# EAGLE design LedArray (EAGLE 9.6.2)
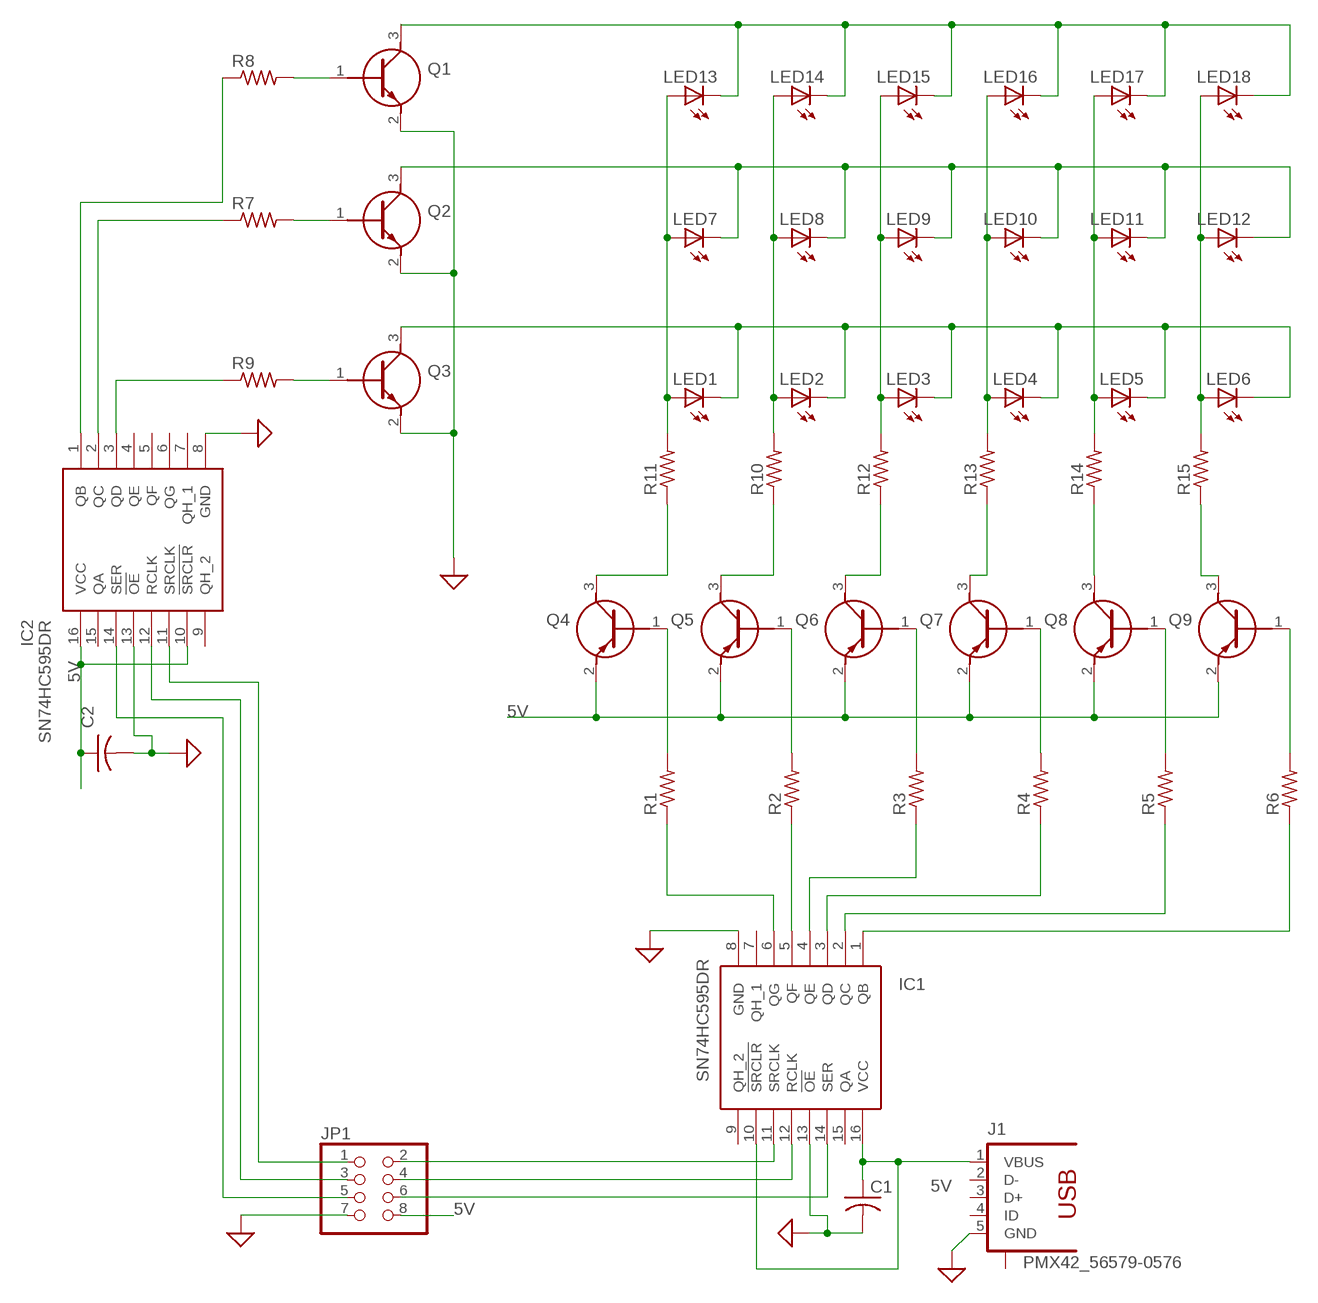
[diagram p0: schematic, sheet 1]

## Parts
C1  C-USC1206  [C1206]
C2  C-USC1206  [C1206]
IC1  SN74HC595DR  [SOIC127P600X175-16N]
IC2  SN74HC595DR  [SOIC127P600X175-16N]
J1  PMX42_56579-0576  [PMX42_56579-0576]
JP1  PINHD-2X4  [2X04]
LED1  LEDSMT1206  [1206]
LED2  LEDSMT1206  [1206]
LED3  LEDSMT1206  [1206]
LED4  LEDSMT1206  [1206]
LED5  LEDSMT1206  [1206]
LED6  LEDSMT1206  [1206]
LED7  LEDSMT1206  [1206]
LED8  LEDSMT1206  [1206]
LED9  LEDSMT1206  [1206]
LED10  LEDSMT1206  [1206]
LED11  LEDSMT1206  [1206]
LED12  LEDSMT1206  [1206]
LED13  LEDSMT1206  [1206]
LED14  LEDSMT1206  [1206]
LED15  LEDSMT1206  [1206]
LED16  LEDSMT1206  [1206]
LED17  LEDSMT1206  [1206]
LED18  LEDSMT1206  [1206]
Q1  MMBT2222A-G  [SOT95P240X115-3N]
Q2  MMBT2222A-G  [SOT95P240X115-3N]
Q3  MMBT2222A-G  [SOT95P240X115-3N]
Q4  MMBT2907A-7-F  [SOT96P240X100-3N]
Q5  MMBT2907A-7-F  [SOT96P240X100-3N]
Q6  MMBT2907A-7-F  [SOT96P240X100-3N]
Q7  MMBT2907A-7-F  [SOT96P240X100-3N]
Q8  MMBT2907A-7-F  [SOT96P240X100-3N]
Q9  MMBT2907A-7-F  [SOT96P240X100-3N]
R1  R-US_R1206  [R1206]
R2  R-US_R1206  [R1206]
R3  R-US_R1206  [R1206]
R4  R-US_R1206  [R1206]
R5  R-US_R1206  [R1206]
R6  R-US_R1206  [R1206]
R7  R-US_R1206  [R1206]
R8  R-US_R1206  [R1206]
R9  R-US_R1206  [R1206]
R10  R-US_R1206  [R1206]
R11  R-US_R1206  [R1206]
R12  R-US_R1206  [R1206]
R13  R-US_R1206  [R1206]
R14  R-US_R1206  [R1206]
R15  R-US_R1206  [R1206]

## Nets
5V: C1.1 C2.1 IC1.10(!SRCLR) IC1.16(VCC) IC2.10(!SRCLR) IC2.16(VCC) J1.1(VBUS) JP1.8 Q4.2(E) Q5.2(E) Q6.2(E) Q7.2(E) Q8.2(E) Q9.2(E)
GND: C1.2 C2.2 IC1.8(GND) IC1.13(!OE) IC2.8(GND) IC2.13(!OE) J1.5(GND) JP1.7 Q1.2(E) Q2.2(E) Q3.2(E) ; supply symbol labelled SUP
N$1: IC1.1(QB) R6.1
N$2: IC1.2(QC) R5.1
N$3: IC1.3(QD) R4.1
N$4: IC1.4(QE) R3.1
N$5: IC1.5(QF) R2.1
N$6: IC1.6(QG) R1.1
N$7: LED1.A LED7.A LED13.A R11.2
N$8: LED2.A LED8.A LED14.A R10.2
N$9: LED3.A LED9.A LED15.A R12.2
N$10: LED4.A LED10.A LED16.A R13.2
N$11: LED5.A LED11.A LED17.A R14.2
N$12: LED6.A LED12.A LED18.A R15.2
N$13: IC2.1(QB) R8.1
N$14: IC2.3(QD) R9.1
N$15: Q4.1(B) R1.2
N$16: Q5.1(B) R2.2
N$17: IC2.2(QC) R7.1
N$18: Q6.1(B) R3.2
N$19: Q1.1(B) R8.2
N$20: Q2.1(B) R7.2
N$21: Q3.1(B) R9.2
N$22: Q7.1(B) R4.2
N$23: Q8.1(B) R5.2
N$24: Q9.1(B) R6.2
N$25: Q5.3(C) R10.1
N$26: Q6.3(C) R12.1
N$27: Q7.3(C) R13.1
N$28: Q9.3(C) R15.1
N$29: Q8.3(C) R14.1
N$30: Q4.3(C) R11.1
N$31: IC2.14(SER) JP1.5
N$32: IC2.12(RCLK) JP1.3
N$33: IC2.11(SRCLK) JP1.1
N$35: IC1.11(SRCLK) JP1.2
N$36: IC1.12(RCLK) JP1.4
N$37: IC1.14(SER) JP1.6
N$43: LED13.C LED14.C LED15.C LED16.C LED17.C LED18.C Q1.3(C)
N$49: LED7.C LED8.C LED9.C LED10.C LED11.C LED12.C Q2.3(C)
N$55: LED1.C LED2.C LED3.C LED4.C LED5.C LED6.C Q3.3(C)
Unconnected: IC1.7(QH_1) IC1.9(QH_2) IC1.15(QA) IC2.4(QE) IC2.5(QF) IC2.6(QG) IC2.7(QH_1) IC2.9(QH_2) IC2.15(QA) J1.2(D-) J1.3(D+) J1.4(ID) J1.S1(S) J1.S2(S) J1.S3(S) J1.S4(S)

## Library data of the parts
C1 C2 = adafruit:C-US: CAPACITOR, American symbol
IC1 IC2 = SamacSys_Parts:SN74HC595DR: 8-Bit Shift Register 3-ST SN74HC595DRG4 SN74HC595DR, 8-stage Shift Register, Serial to Serial/Parallel, 2 ???????? 6 V, 16-Pin SOIC%0 Source: Datasheet <http://www.ti.com/lit/ds/symlink/sn74hc595.pdf>; ARROW_PART_NUMBER: SN74HC595DR; ARROW_PRICE-STOCK: https://www.arrow.com/en/products/sn74hc595dr/texas-instruments; DESCRIPTION: 8-Bit Shift Register 3-ST SN74HC595DRG4 SN74HC595DR, 8-stage Shift Register, Serial to Serial/Parallel, 2 ???????? 6 V, 16-Pin SOIC%0; HEIGHT: 1.75mm; MANUFACTURER_NAME: Texas Instruments; MANUFACTURER_PART_NUMBER: SN74HC595DR; MOUSER_PART_NUMBER: 595-SN74HC595DR; MOUSER_PRICE-STOCK: https://www.mouser.co.uk/ProductDetail/Texas-Instruments/SN74HC595DR?qs=YEaxc5757jOSYfchesGb7w%3D%3D
J1 = 52101-101-REV-A_v16:PMX42_56579-0576: USB - OTG, miniUSB Type AB, Molex
JP1 = adafruit:PINHD-2X4: PIN HEADER
LED1-LED18 = adafruit:LED: LED OSRAM: - CHIPLED LG R971, LG N971, LY N971, LG Q971, LY Q971, LO R971, LY R971 LH N974, LH R974 LS Q976, LO Q976, LY Q976 LO Q996 - Hyper CHIPLED LW Q18S LB Q993, LB Q99A, LB R99A - SideLED LS A670, LO A670, LY A670, LG A670, LP A670 LB A673, LV A673, LT A673, LW A673 LH A674 LY A675 LS A676, LA A676, LO A676, LY A676, LW A676 LS A679, LY A679, LG A679 - Hyper Micro SIDELED® LS Y876, LA Y876, LO Y876, LY Y876 LT Y87S - SmartLED LW L88C, LW L88S LB L89C, LB L89S, LG L890 LS L89K, LO L89K, LY L89K LS L896, LA L896, LO L896, LY L896 - TOPLED LS T670, LO T670, LY T670, LG T670, LP T670 LSG T670, LSP T670, LSY T670, LOP T670, LYG T670 LG T671, LOG T671, LSG T671 LB T673, LV T673, LT T673, LW T673 LH T674 LS T676, LA T676, LO T676, LY T676, LB T676, LH T676, LSB T676, LW T676 LB T67C, LV T67C, LT T67C, LS T67K, LO T67K, LY T67K, LW E67C LS E67B, LA E67B, LO E67B, LY E67B, LB E67C, LV E67C, LT E67C LW T67C LS T679, LY T679, LG T679 LS T770, LO T770, LY T770, LG T770, LP T770 LB T773, LV T773, LT T773, LW T773 LH T774 LS E675, LA E675, LY E675, LS T675 LS T776, LA T776, LO T776, LY T776, LB T776 LHGB T686 LT T68C, LB T68C - Hyper Mini TOPLED® LB M676 - Mini TOPLED Santana® LG M470 LS M47K, LO M47K, LY M47K Source: http://www.osram.convergy.de/
Q1-Q3 = SamacSys_Parts:MMBT2222A-G: RF Bipolar Transistors Source: Datasheet <http://www.comchiptech.com/admin/files/product/MMBT2222A-G RevB.pdf>; ARROW_PART_NUMBER: MMBT2222A-G; ARROW_PRICE-STOCK: https://www.arrow.com/en/products/mmbt2222a-g/comchip-technology; DESCRIPTION: RF Bipolar Transistors; HEIGHT: 1.15mm; MANUFACTURER_NAME: Comchip Technology; MANUFACTURER_PART_NUMBER: MMBT2222A-G; MOUSER_PART_NUMBER: 750-MMBT2222A-G; MOUSER_PRICE-STOCK: https://www.mouser.co.uk/ProductDetail/Comchip-Technology/MMBT2222A-G?qs=2qJf6qQ4IOIM%2FSE9iCL8gQ%3D%3D
Q4-Q9 = SamacSys_Parts:MMBT2907A-7-F: Diodes Inc MMBT2907A-7-F PNP Bipolar Transistor, -600 mA, -60 V, 3-Pin SOT-23 Source: Datasheet <https://www.diodes.com/assets/Datasheets/ds30040.pdf>; ARROW_PART_NUMBER: MMBT2907A-7-F; ARROW_PRICE-STOCK: https://www.arrow.com/en/products/mmbt2907a-7-f/diodes-incorporated; DESCRIPTION: Diodes Inc MMBT2907A-7-F PNP Bipolar Transistor, -600 mA, -60 V, 3-Pin SOT-23; HEIGHT: 1mm; MANUFACTURER_NAME: Diodes Inc.; MANUFACTURER_PART_NUMBER: MMBT2907A-7-F; MOUSER_PART_NUMBER: 621-MMBT2907A-F; MOUSER_PRICE-STOCK: https://www.mouser.co.uk/ProductDetail/Diodes-Incorporated/MMBT2907A-7-F?qs=nzdy8YbEw1%252BnciVJrv5MLg%3D%3D
R1-R15 = adafruit:R-US_: RESISTOR, American symbol

## Net classes
0 5V: width 0.508 mm

## Board
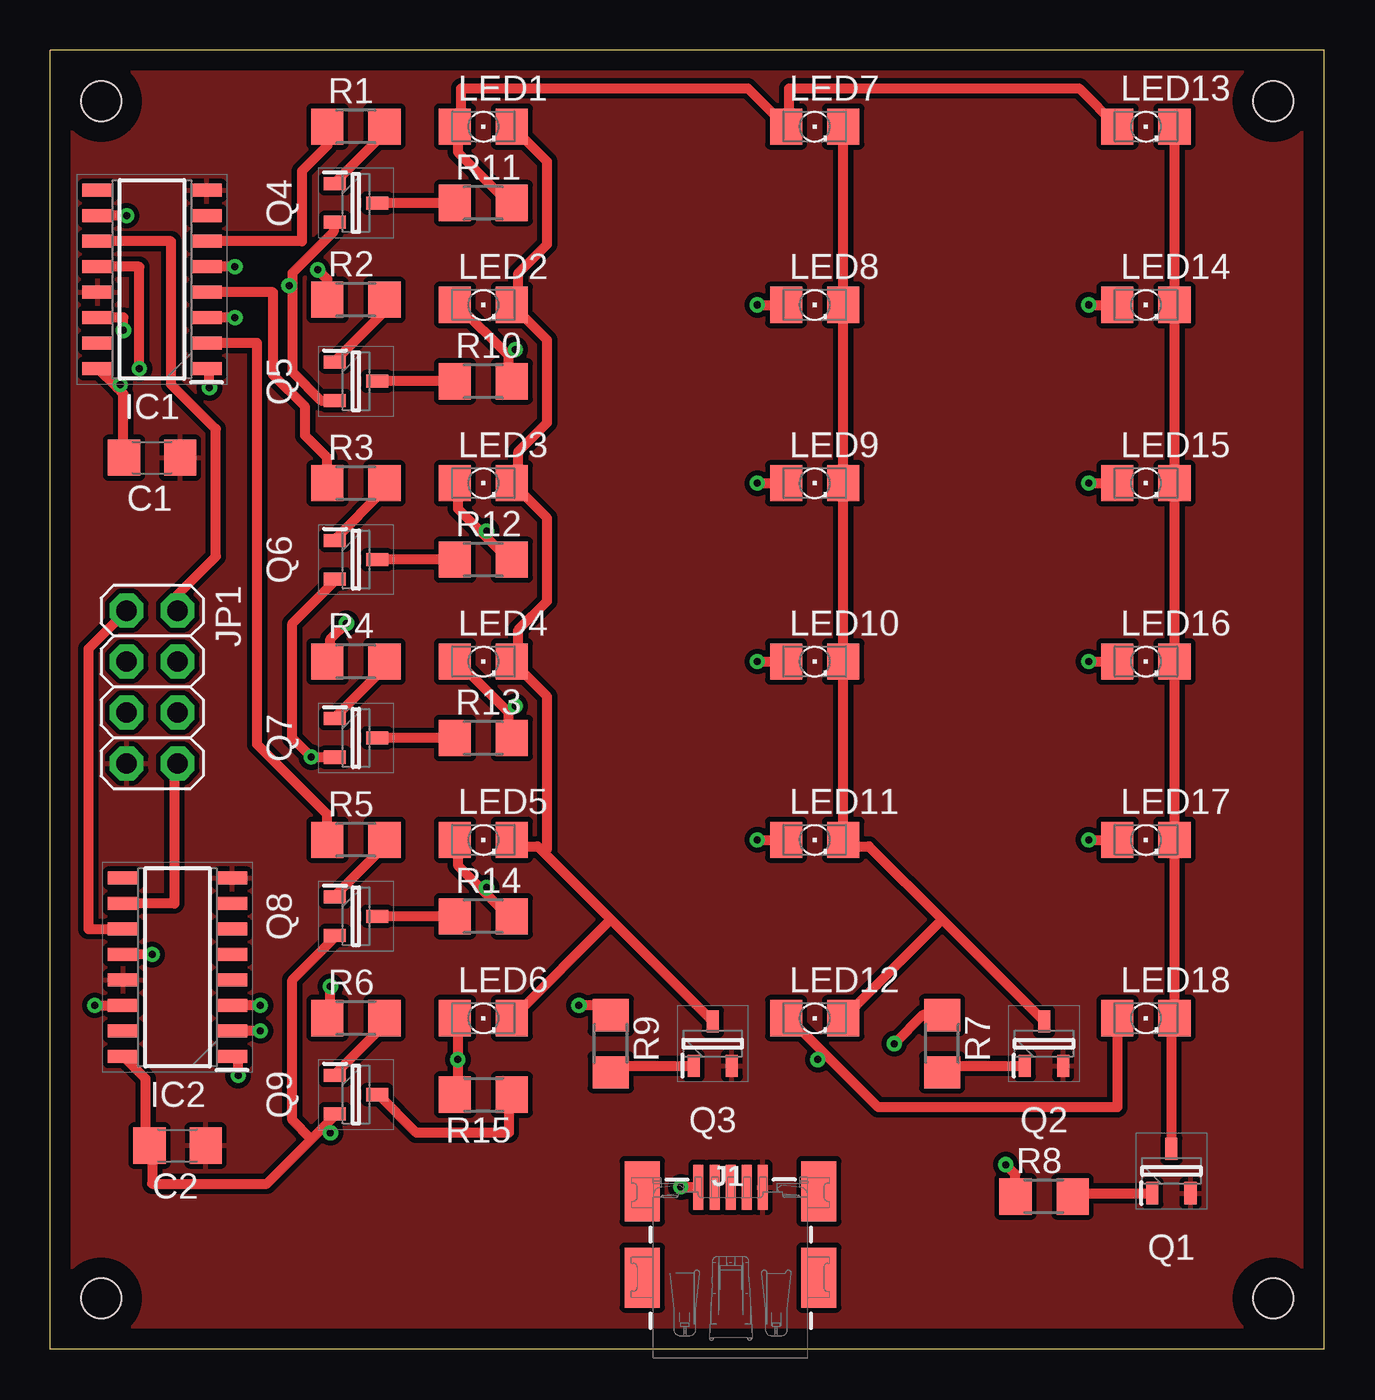
[diagram p1: board, top side]
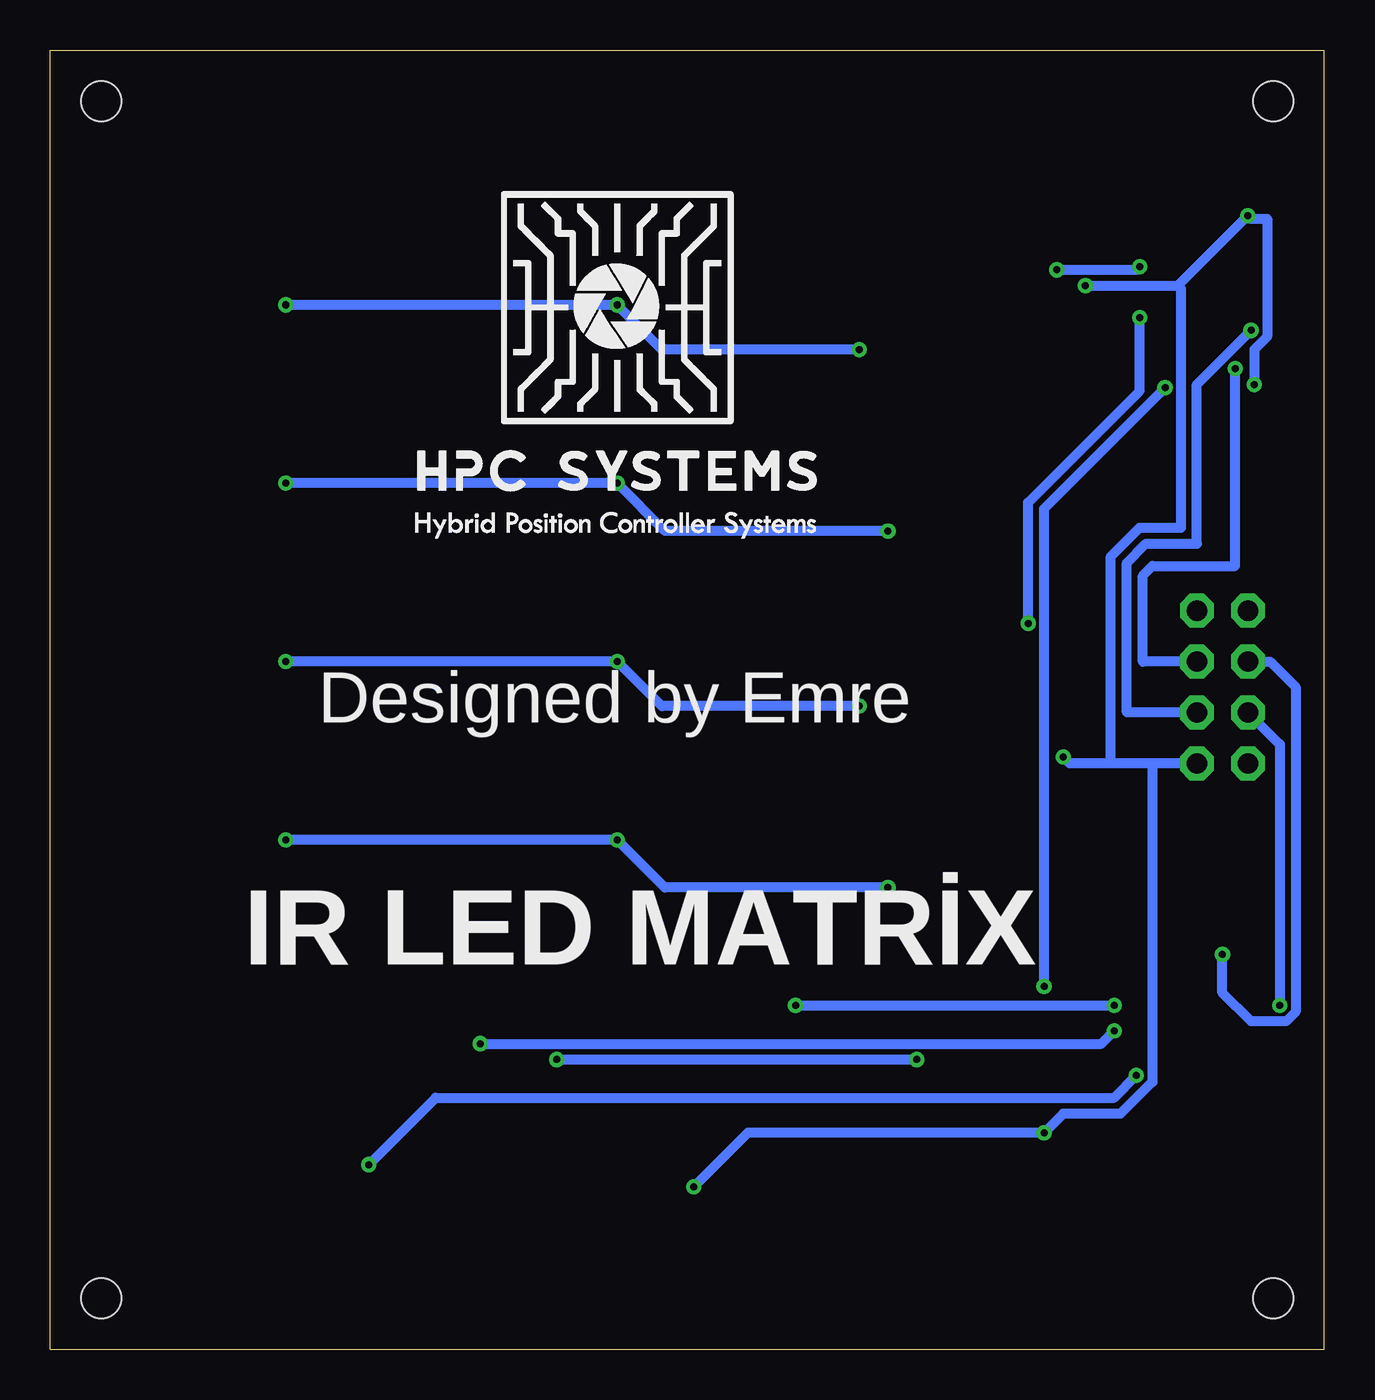
[diagram p2: board, bottom side, seen from below]

Size 63.5 x 64.77 mm. Coordinates in mm from the lower left corner, seen from the top.
Outline: 63.5,0 63.5,64.77 0,64.77 0,0 63.5,0
Copper layers (1*16): Top 0.035mm / dielectric 1.5mm / Bottom 0.035mm
Design rules "default *": minimum track width 6mil, minimum drill 0.35mm, track to track 10mil, track to pad 10mil, pad to pad 6mil, via to via 6mil, smd to smd 6mil, copper to edge 40mil, drill to drill 6mil, minimum pad ring 10mil, minimum via ring 8mil, stop-mask expansion 4mil, vias tented up to drill 0mil, thermal gap 10mil
Holes 2 mm at 2.54,62.23 60.96,62.23 60.96,2.54 2.54,2.54

### Footprints (pad centres in the part's own frame; a part is rotated, then mirrored left to right if it is on the bottom)
C1206 = smd 1.6 x 1.8: 1 -1.4,0; 2 1.4,0
SOIC127P600X175-16N = smd 1.525 x 0.65: 1 -2.712,4.445; 2 -2.712,3.175; 3 -2.712,1.905; 4 -2.712,0.635; 5 -2.712,-0.635; 6 -2.712,-1.905; 7 -2.712,-3.175; 8 -2.712,-4.445; 9 2.712,-4.445; 10 2.712,-3.175; 11 2.712,-1.905; 12 2.712,-0.635; 13 2.712,0.635; 14 2.712,1.905; 15 2.712,3.175; 16 2.712,4.445
PMX42_56579-0576 = smd 0.5 x 2.25: 1 1.6,-0.2; 2 0.8,-0.2; 3 0,-0.2; 4 -0.8,-0.2; 5 -1.6,-0.2 | smd 1.75 x 3: S1 -4.4,0; S2 4.4,0; S3 -4.4,4.3; S4 4.4,4.3
2X04 = drill 1.016 pad 1.676 octagon: 1 -3.81,-1.27; 2 -3.81,1.27; 3 -1.27,-1.27; 4 -1.27,1.27; 5 1.27,-1.27; 6 1.27,1.27; 7 3.81,-1.27; 8 3.81,1.27
1206 = smd 1.6 x 1.803: A -1.422,0; C 1.422,0
SOT95P240X115-3N = smd 1.1 x 0.6: 1 -1.1,0.95; 2 -1.1,-0.95; 3 1.1,0
SOT96P240X100-3N = smd 1.1 x 0.65: 1 -1.05,0.96; 2 -1.05,-0.96; 3 1.05,0
R1206 = smd 1.6 x 1.803: 1 -1.422,0; 2 1.422,0

### Placement (x,y rotation side)
C1  5.08,44.45 0 top
C2  6.35,10.16 0 top
IC1  5.08,53.34 180 top
IC2  6.35,19.05 180 top
J1  33.91,7.87 180 top
JP1  5.08,33.02 270 top
LED1  21.59,60.96 0 top
LED2  21.59,52.07 0 top
LED3  21.59,43.18 0 top
LED4  21.59,34.29 0 top
LED5  21.59,25.4 0 top
LED6  21.59,16.51 0 top
LED7  38.1,60.96 0 top
LED8  38.1,52.07 0 top
LED9  38.1,43.18 0 top
LED10  38.1,34.29 0 top
LED11  38.1,25.4 0 top
LED12  38.1,16.51 0 top
LED13  54.61,60.96 0 top
LED14  54.61,52.07 0 top
LED15  54.61,43.18 0 top
LED16  54.61,34.29 0 top
LED17  54.61,25.4 0 top
LED18  54.61,16.51 0 top
Q1  55.88,8.89 90 top
Q2  49.53,15.24 90 top
Q3  33.02,15.24 90 top
Q4  15.24,57.15 0 top
Q5  15.24,48.26 0 top
Q6  15.24,39.37 0 top
Q7  15.24,30.48 0 top
Q8  15.24,21.59 0 top
Q9  15.24,12.7 0 top
R1  15.24,60.96 0 top
R2  15.24,52.32 0 top
R3  15.24,43.18 0 top
R4  15.24,34.29 0 top
R5  15.24,25.4 0 top
R6  15.24,16.51 0 top
R7  44.45,15.24 270 top
R8  49.53,7.62 0 top
R9  27.94,15.24 270 top
R10  21.59,48.26 0 top
R11  21.59,57.15 0 top
R12  21.59,39.37 0 top
R13  21.59,30.48 0 top
R14  21.59,21.59 0 top
R15  21.59,12.7 180 top

### Tracks (layer width: path | path; a pad name or v marks a point on that pad's centre or on a via)
5V  (via drill 0.35)
  Top 0.508: 13.02,10.48 10.79,8.26 5.08,8.26 5.08,10.16 C2.1 4.76,10.32 4.76,13.49 3.65,14.61 IC2.16 | 13.02,10.48 13.65,11.11 | 13.65,11.11 14.13,11.59 Q9.2 | 13.02,10.48 12.06,11.43 12.06,18.41 14.13,20.48 Q8.2 | v31.43,8.1 32.23,8.1 J1.1 | v13.97,10.79 13.65,11.11 | 3.33,47.94 3.65,47.62 3.65,44.45 C1.1 | 3.33,47.94 2.38,48.9 IC1.16 | 12.06,53.02 12.06,53.66 14.13,55.72 14.13,56.04 Q4.2 | 12.06,53.02 12.06,48.74 13.49,47.31 14.13,47.31 Q5.2 | v3.81,56.52 IC1.10 | v11.91,53.02 12.06,53.02 | v3.49,48.1 3.33,47.94 | Q7.2 14.13,29.53 v13.02,29.53 12.06,30.48 12.06,36.2 14.13,38.26 Q6.2 | IC2.10 6.19,22.23 6.19,29.05 JP1.8
  Bottom 0.508: v31.43,8.1 28.73,10.79 v13.97,10.79 13.02,11.75 10.16,11.75 8.57,13.34 8.57,29.21 | 7.3,53.02 v3.81,56.52 3.65,56.36 2.86,56.36 2.86,50.48 3.49,49.85 v3.49,48.1 | v11.91,53.02 7.3,53.02 | v13.02,29.53 12.7,29.21 10.64,29.21 | JP1.8 8.57,29.21 | 8.57,29.21 10.64,29.21 | 10.64,29.21 10.64,39.53 9.21,40.96 7.14,40.96 7.14,52.86 7.3,53.02
GND
  pour Top: 0,64.77 0,0 63.5,0 63.5,64.77
N$1  (via drill 0.35)
  Top 0.508: v7.94,47.94 7.94,48.9 IC1.1 | v13.97,18.1 13.97,16.51 R6.1
  Bottom 0.508: v7.94,47.94 13.97,41.91 v13.97,18.1
N$2
  Top 0.508: IC1.2 10.32,50.16 10.32,30.16 13.81,26.67 R5.1
N$3  (via drill 0.35)
  Top 0.508: v9.21,51.44 IC1.3 | v14.76,36.2 13.97,35.4 13.97,34.29 R4.1
  Bottom 0.508: v9.21,51.44 9.21,47.78 14.76,42.23 v14.76,36.2
N$4
  Top 0.508: IC1.4 11.11,52.7 11.11,48.58 12.7,46.99 12.7,45.56 13.81,44.45 R3.1
N$5  (via drill 0.35)
  Top 0.508: v9.21,53.98 IC1.5 | v13.34,53.82 13.81,53.34 13.81,52.39 R2.1
  Bottom 0.508: v9.21,53.98 9.37,53.82 v13.34,53.82
N$6
  Top 0.508: IC1.6 12.54,55.24 12.54,58.74 13.81,60.01 R1.1
N$7
  Top 0.508: R11.2 22.86,57.15 20.32,59.69 20.32,60.96 LED1.A 20.48,61.12 20.48,62.87 34.77,62.87 LED7.A 36.83,61.12 36.83,62.87 51.28,62.87 LED13.A
N$8  (via drill 0.35)
  Top 0.508: 22.86,49.53 20.32,52.07 LED2.A | 22.86,49.53 22.86,48.26 R10.2 | v35.24,52.07 LED8.A | v23.18,49.85 22.86,49.53 | v51.75,52.07 LED14.A
  Bottom 0.508: v23.18,49.85 33.02,49.85 v35.24,52.07 v51.75,52.07
N$9  (via drill 0.35)
  Top 0.508: 21.59,40.64 20.32,41.91 20.32,43.18 LED3.A | 21.59,40.64 22.86,39.37 R12.2 | v35.24,43.18 LED9.A | v21.75,40.8 21.59,40.64 | v51.75,43.18 LED15.A
  Bottom 0.508: v21.75,40.8 32.86,40.8 v35.24,43.18 v51.75,43.18
N$10  (via drill 0.35)
  Top 0.508: 22.86,31.75 20.32,34.29 LED4.A | 22.86,31.75 22.86,30.48 R13.2 | v35.24,34.29 LED10.A | v23.18,32.07 22.86,31.75 | v51.75,34.29 LED16.A
  Bottom 0.508: v23.18,32.07 33.02,32.07 v35.24,34.29 v51.75,34.29
N$11  (via drill 0.35)
  Top 0.508: 21.59,22.86 20.32,24.13 20.32,25.4 LED5.A | 21.59,22.86 22.86,21.59 R14.2 | v35.24,25.4 LED11.A | v21.75,23.02 21.59,22.86 | v51.75,25.4 LED17.A
  Bottom 0.508: v21.75,23.02 32.86,23.02 v35.24,25.4 v51.75,25.4
N$12  (via drill 0.35)
  Top 0.508: R15.2 20.32,12.7 v20.32,14.45 20.32,16.51 LED6.A | 38.58,14.76 41.27,12.06 53.18,12.06 LED18.A | 38.58,14.76 36.83,16.51 LED12.A | v38.26,14.45 38.58,14.76
  Bottom 0.508: v38.26,14.45 v20.32,14.45
N$13  (via drill 0.35)
  Top 0.508: v9.37,13.65 9.37,14.45 9.21,14.61 IC2.1 | v47.62,9.21 48.1,8.73 R8.1
  Bottom 0.508: v9.37,13.65 10.48,12.54 44.29,12.54 v47.62,9.21
N$14  (via drill 0.35)
  Top 0.508: v10.48,17.14 IC2.3 | v26.35,17.14 27.94,17.14 R9.1
  Bottom 0.508: v26.35,17.14 v10.48,17.14
N$15
  Top 0.508: Q4.1 14.29,58.26 16.51,60.48 16.51,60.96 R1.2
N$16
  Top 0.508: Q5.1 14.29,49.37 16.51,51.59 16.51,52.23 R2.2
N$17  (via drill 0.35)
  Top 0.508: v10.48,15.88 IC2.2 | R7.1 43.49,16.66 v42.07,15.24
  Bottom 0.508: v10.48,15.88 11.11,15.24 v42.07,15.24
N$18
  Top 0.508: Q6.1 14.29,40.48 16.51,42.7 16.51,43.18 R3.2
N$19
  Top 0.508: Q1.1 50.96,7.78 R8.2
N$20
  Top 0.508: R7.2 44.45,14.13 48.58,14.13 Q2.1
N$21
  Top 0.508: R9.2 27.94,14.13 32.07,14.13 Q3.1
N$22
  Top 0.508: Q7.1 14.29,31.59 16.51,33.81 16.51,34.29 R4.2
N$23
  Top 0.508: Q8.1 14.29,22.7 16.51,24.92 16.51,25.4 R5.2
N$24
  Top 0.508: Q9.1 14.29,13.81 16.51,16.03 16.51,16.51 R6.2
N$25
  Top 0.508: R10.1 Q5.3
N$26
  Top 0.508: R12.1 Q6.3
N$27
  Top 0.508: R13.1 Q7.3
N$28
  Top 0.508: Q9.3 16.35,12.7 18.26,10.79 22.86,10.79 22.86,12.7 R15.1
N$29
  Top 0.508: R14.1 Q8.3
N$30
  Top 0.508: R11.1 Q4.3
N$31  (via drill 0.35)
  Top 0.508: v2.22,17.14 IC2.14
  Bottom 0.508: v2.22,17.14 2.22,30.16 JP1.5
N$32  (via drill 0.35)
  Top 0.508: v5.08,19.68 IC2.12
  Bottom 0.508: v5.08,19.68 5.08,17.78 3.65,16.35 1.91,16.35 1.43,16.83 1.43,33.02 2.7,34.29 JP1.3
N$33
  Top 0.508: IC2.11 1.91,20.95 1.91,34.92 JP1.1
N$35
  Top 0.508: IC1.11 6.03,55.24 6.03,48.1 8.26,45.88 8.26,39.53 6.35,37.62 JP1.2
N$36  (via drill 0.35)
  Top 0.508: IC1.12 4.45,53.98 v4.45,48.9
  Bottom 0.508: v4.45,48.9 4.45,39.05 8.57,39.05 9.05,38.58 9.05,34.29 JP1.4
N$37  (via drill 0.35)
  Top 0.508: IC1.14 3.65,51.44 v3.65,50.8
  Bottom 0.508: v3.65,50.8 6.35,48.1 6.35,40.16 8.89,40.16 9.84,39.21 9.84,31.75 JP1.6
N$43
  Top 0.508: Q1.3 55.88,16.51 LED18.C 56.04,16.67 LED17.C 56.04,25.56 LED16.C 56.04,34.45 LED15.C 56.04,43.34 LED14.C 56.04,52.23 LED13.C
N$49
  Top 0.508: 44.45,21.43 40.8,25.08 39.53,25.08 LED11.C 39.53,25.56 LED10.C 39.53,34.45 LED9.C 39.53,43.34 LED8.C 39.53,52.23 LED7.C | 44.45,21.43 Q2.3 | 44.45,21.43 LED12.C
N$55
  Top 0.508: 24.61,24.77 24.29,25.08 23.02,25.08 LED5.C | 24.61,24.77 27.94,21.43 | 27.94,21.43 Q3.3 | 27.94,21.43 LED6.C | 24.61,24.77 24.77,24.92 24.77,32.54 LED4.C 23.34,34.29 23.34,35.88 24.77,37.31 24.77,41.43 LED3.C 23.34,43.18 23.34,44.77 24.77,46.2 24.77,50.32 LED2.C 23.34,52.07 23.34,53.66 24.77,55.09 24.77,59.21 LED1.C

### Text on the board
bPlace: Designed by Emre | IR LED MATRİX